# Altium schematic sheet Ethernet.SchDoc: 100/1000M Ethernet interface
size A4
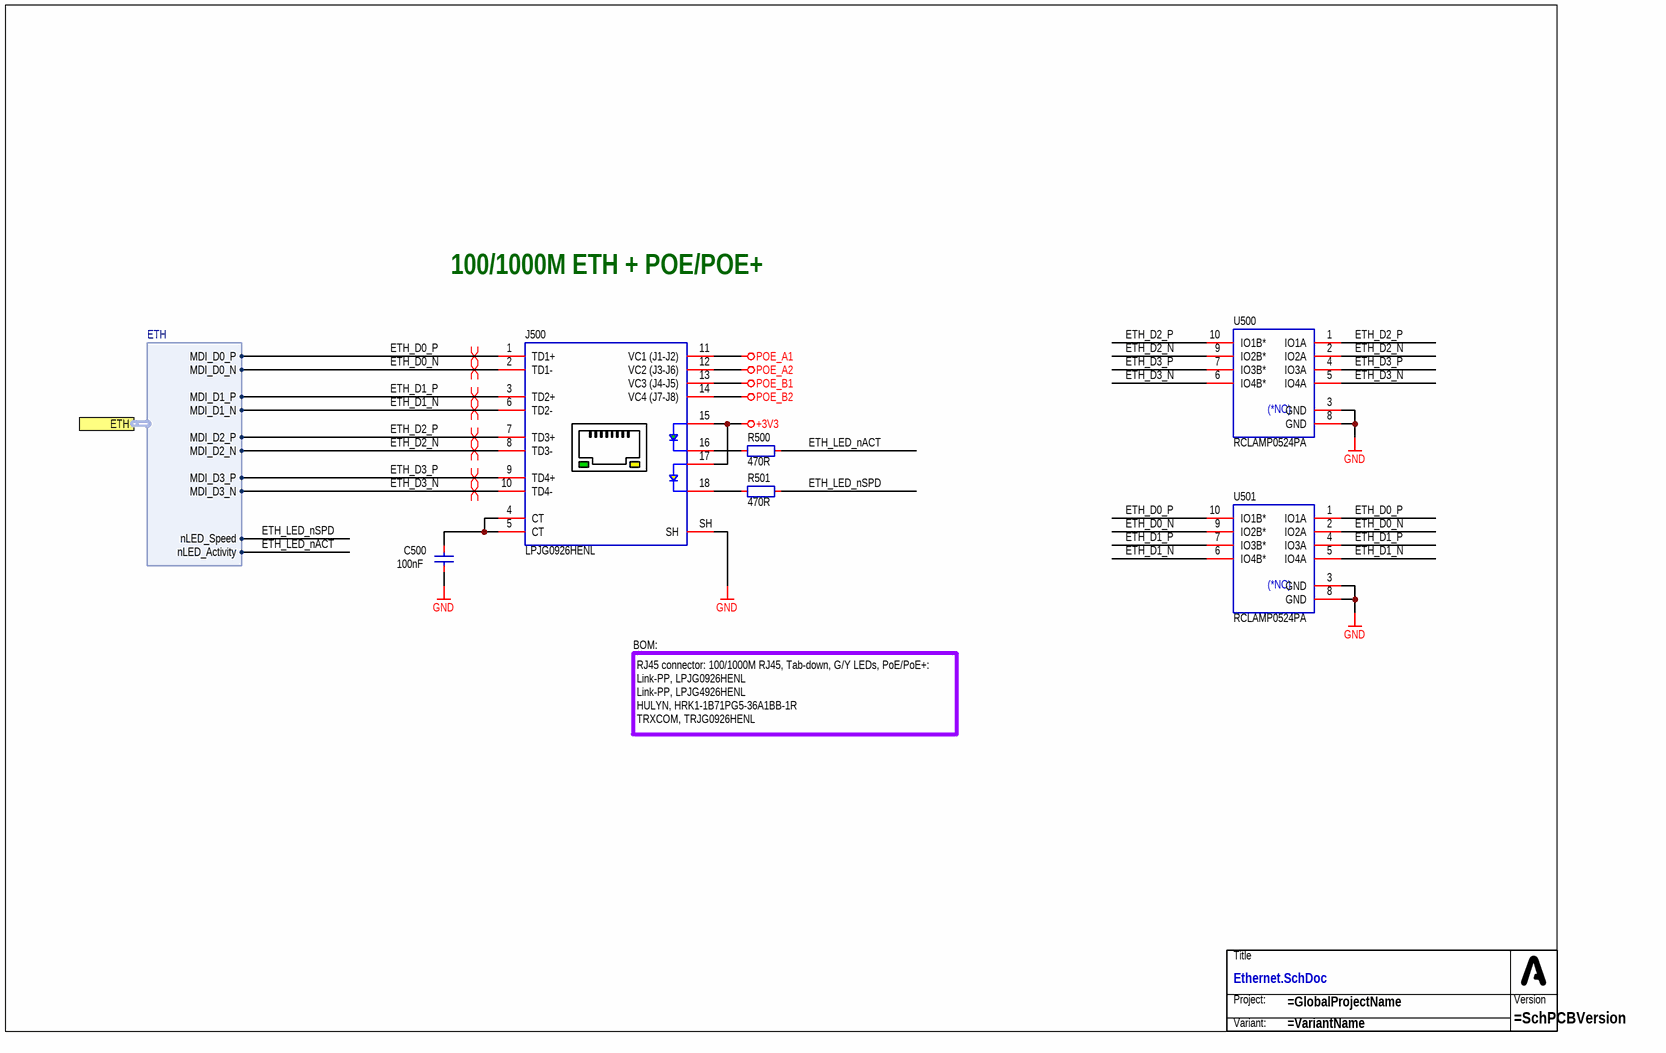
[diagram p0: Ethernet.SchDoc]

## Parts
C500  100nF  [CAP_0603_R]
J500  LPJG0926HENL  [CON_LPP_LPJG0926HENL]
R500  470R  [RES_0603_R]
R501  470R  [RES_0603_R]
TB500  (no value)  (no BOM)
U500  RCLAMP0524PA  [ICC_SLP2510P8_250X100X60_P50_R]
U501  RCLAMP0524PA  [ICC_SLP2510P8_250X100X60_P50_R]

## Ports
ETH (harness ETH)

## Harnesses
ETH: MDI_D0_P, MDI_D0_N, MDI_D1_P, MDI_D1_N, MDI_D2_P, MDI_D2_N, MDI_D3_P, MDI_D3_N, nLED_Speed, nLED_Activity

## Nets
+3V3: J500.15(GRN_A) J500.17(YLW_A)
GND: C500.1 J500.SH U500.3(GND) U500.8(GND) U501.3(GND) U501.8(GND)
POE_A1: J500.11(VC1_(J1-J2))
POE_A2: J500.12(VC2_(J3-J6))
POE_B1: J500.13(VC3_(J4-J5))
POE_B2: J500.14(VC4_(J7-J8))
ETH_D0_N: J500.2(TD1-) U501.2(IO2A) U501.9(IO2B*) ; port ETH.MDI_D0_N
ETH_D0_P: J500.1(TD1+) U501.1(IO1A) U501.10(IO1B*) ; port ETH.MDI_D0_P
ETH_D1_N: J500.6(TD2-) U501.5(IO4A) U501.6(IO4B*) ; port ETH.MDI_D1_N
ETH_D1_P: J500.3(TD2+) U501.4(IO3A) U501.7(IO3B*) ; port ETH.MDI_D1_P
ETH_D2_N: J500.8(TD3-) U500.2(IO2A) U500.9(IO2B*) ; port ETH.MDI_D2_N
ETH_D2_P: J500.7(TD3+) U500.1(IO1A) U500.10(IO1B*) ; port ETH.MDI_D2_P
ETH_D3_N: J500.10(TD4-) U500.5(IO4A) U500.6(IO4B*) ; port ETH.MDI_D3_N
ETH_D3_P: J500.9(TD4+) U500.4(IO3A) U500.7(IO3B*) ; port ETH.MDI_D3_P
ETH_LED_nACT: R500.1 ; port ETH.nLED_Activity
ETH_LED_nSPD: R501.1 ; port ETH.nLED_Speed
NetC500_2: C500.2 J500.4(CT) J500.5(CT)
NetJ500_16: J500.16(GRN_K) R500.2
NetJ500_18: J500.18(YLW_K) R501.2

## Layout directives
differential pair: ETH_D0_N, ETH_D0_P, ETH_D1_N, ETH_D1_P, ETH_D2_N, ETH_D2_P, ETH_D3_N, ETH_D3_P

## Notes on the sheet
- 100/1000M ETH + POE/POE+
- BOM:
- RJ45 connector: 100/1000M RJ45, Tab-down, G/Y LEDs, PoE/PoE+:
  Link-PP, LPJG0926HENL
  Link-PP, LPJG4926HENL
  HULYN, HRK1-1B71PG5-36A1BB-1R
  TRXCOM, TRJG0926HENL
- (in symbol ICC-0005) (*NC)
- (in symbol SCH_TITLE_BLOCK_SIMPLE_NODATE) Title; Project:; Version; Variant:

## Library data of the parts
C500 = CAP-0008: Capacitor; MLCC; 100nF; 10V X5R; Manufacturer: YAGEO; MPN: CC0603KRX7R9BB104; Package (Case): 0603; Component Type: Capacitor; Component Subtype: MLCC; Value: 100nF; Mounting Type: SMD
J500 = CON_LPP_LPJG0926HENL: Connector; RJ45;; Manufacturer: Link-PP; Package (Case): THT; Component Subtype: RJ45; Component Type: Connector; Mounting Type: THT; MPN: LPJG0926HENL; Value: LPJG0926HENL
R500 R501 = RES-0042: Resistor; Thick Film; 470R; 1%; 100mW; 100PPM; 75V; Standard; SMD; 0603 (1608);; Manufacturer: UNI-ROYAL(Uniroyal Elec); MPN: 0603WAF4700T5E; Package (Case): 0603; Component Type: Resistor; Component Subtype: Thick Film; Value: 470R; Mounting Type: SMD
TB500 = SCH_TITLE_BLOCK_SIMPLE_NODATE
U500 U501 = ICC-0005: IC; TVS Arrays; ESD Protection; 4-Channel; 17kV Air; 12kV Contact; 0.3pF Capitance; TBD; SMD; TBD;; Manufacturer: Semtech Corporation; MPN: RCLAMP0524PATCT; Package (Case): DFN-10(1x2.5); Component Type: IC; Component Subtype: TVS Arrays; Value: RCLAMP0524PA; Mounting Type: SMD